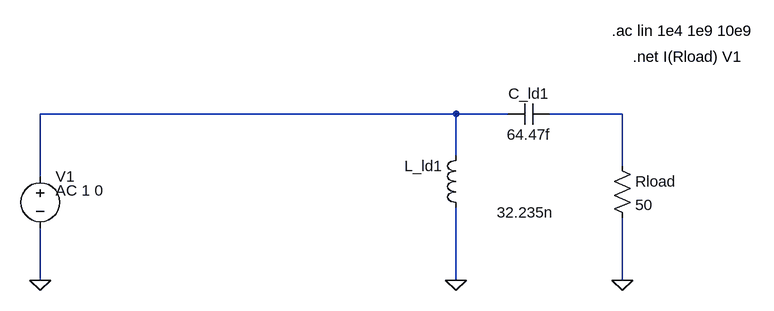
[diagram p0: schematic matching_network.asc]
matching_network.asc, the LTspice schematic file:
Version 4
SHEET 1 1264 680
WIRE 736 224 96 224
WIRE 816 224 736 224
WIRE 992 224 880 224
WIRE 736 288 736 224
WIRE 992 304 992 224
WIRE 96 320 96 224
WIRE 96 480 96 400
WIRE 736 480 736 368
WIRE 992 480 992 384
FLAG 736 480 0
FLAG 992 480 0
FLAG 96 480 0
SYMBOL ind 752 384 R180
WINDOW 0 36 80 Left 2
WINDOW 3 -135 8 Left 2
SYMATTR InstName L_ld1
SYMATTR Value 32.235n
SYMBOL cap 880 208 R90
WINDOW 0 0 32 VBottom 2
WINDOW 3 32 32 VTop 2
SYMATTR InstName C_ld1
SYMATTR Value 64.47f
SYMBOL Res 976 288 R0
SYMATTR InstName Rload
SYMATTR Value 50
SYMBOL voltage 96 304 R0
WINDOW 123 24 38 Left 2
SYMATTR Value2 AC 1 0
SYMATTR InstName V1
SYMATTR Value ""
TEXT 976 96 Left 2 !.ac lin 1e4 1e9 10e9
TEXT 1008 136 Left 2 !.net I(Rload) V1

The netlist it stands for:
* matching_network.asc
L_ld1 0 N001 32.235n
C_ld1 N002 N001 64.47f
Rload N002 0 50
V1 N001 0 AC 1 0
.ac lin 1e4 1e9 10e9
.net I(Rload) V1
.backanno
.end